# EAGLE schematic PSPS_AVNC_SRD_fullBoard-2020-01-31 (EAGLE 9.5.1)
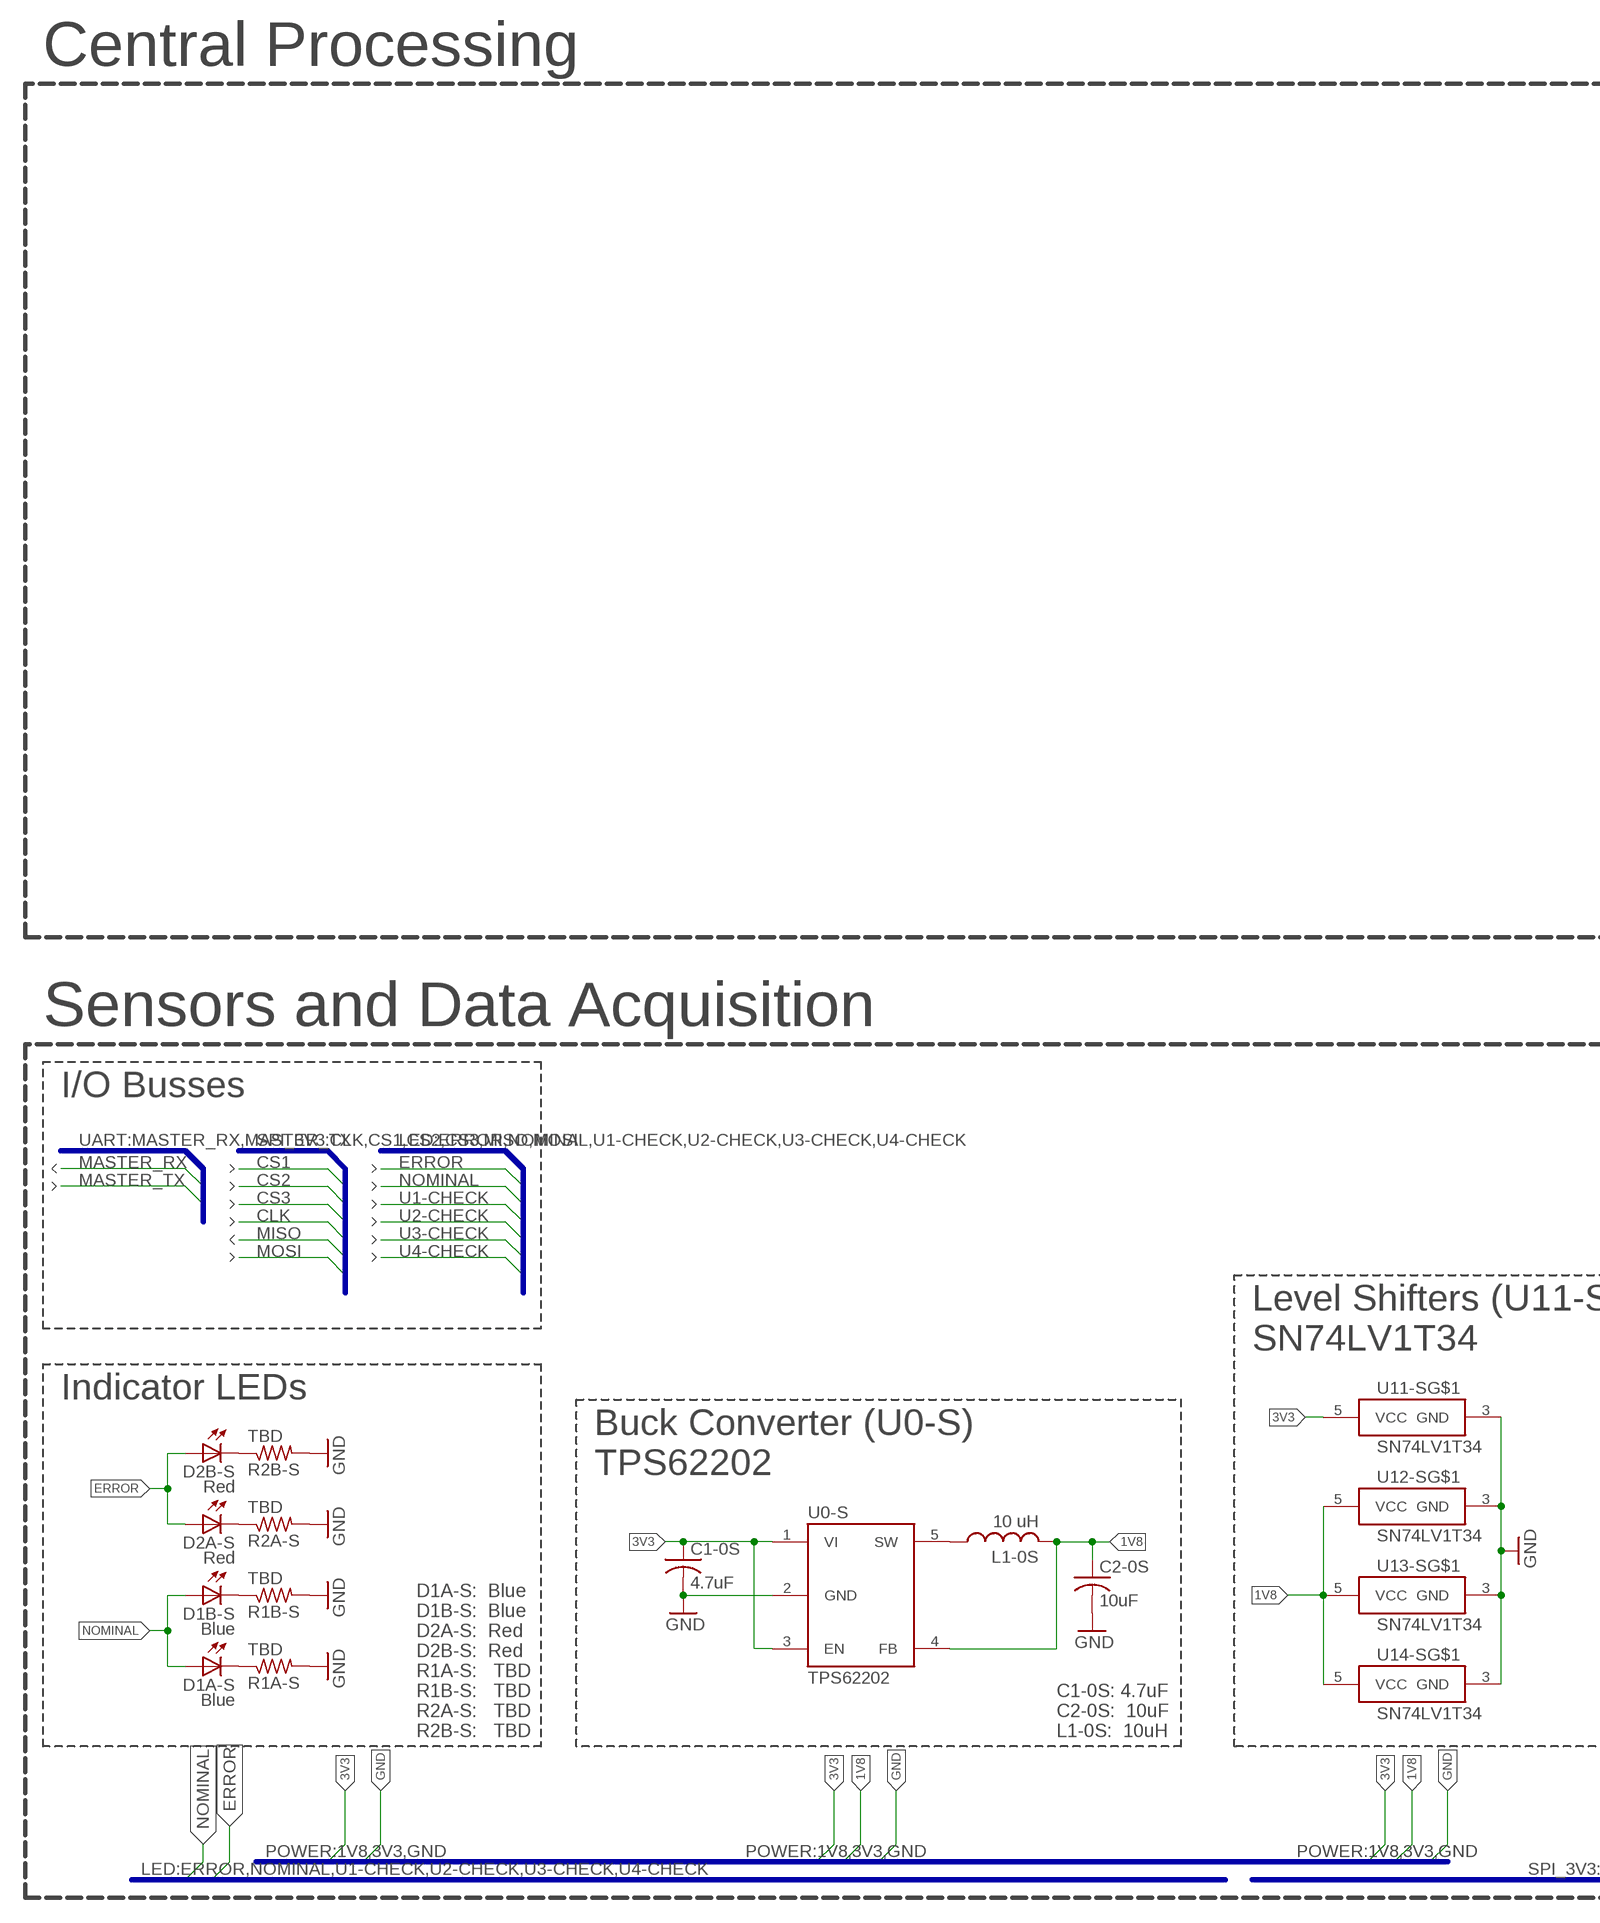
[diagram p0: schematic, sheet 1, part 1 of 2]
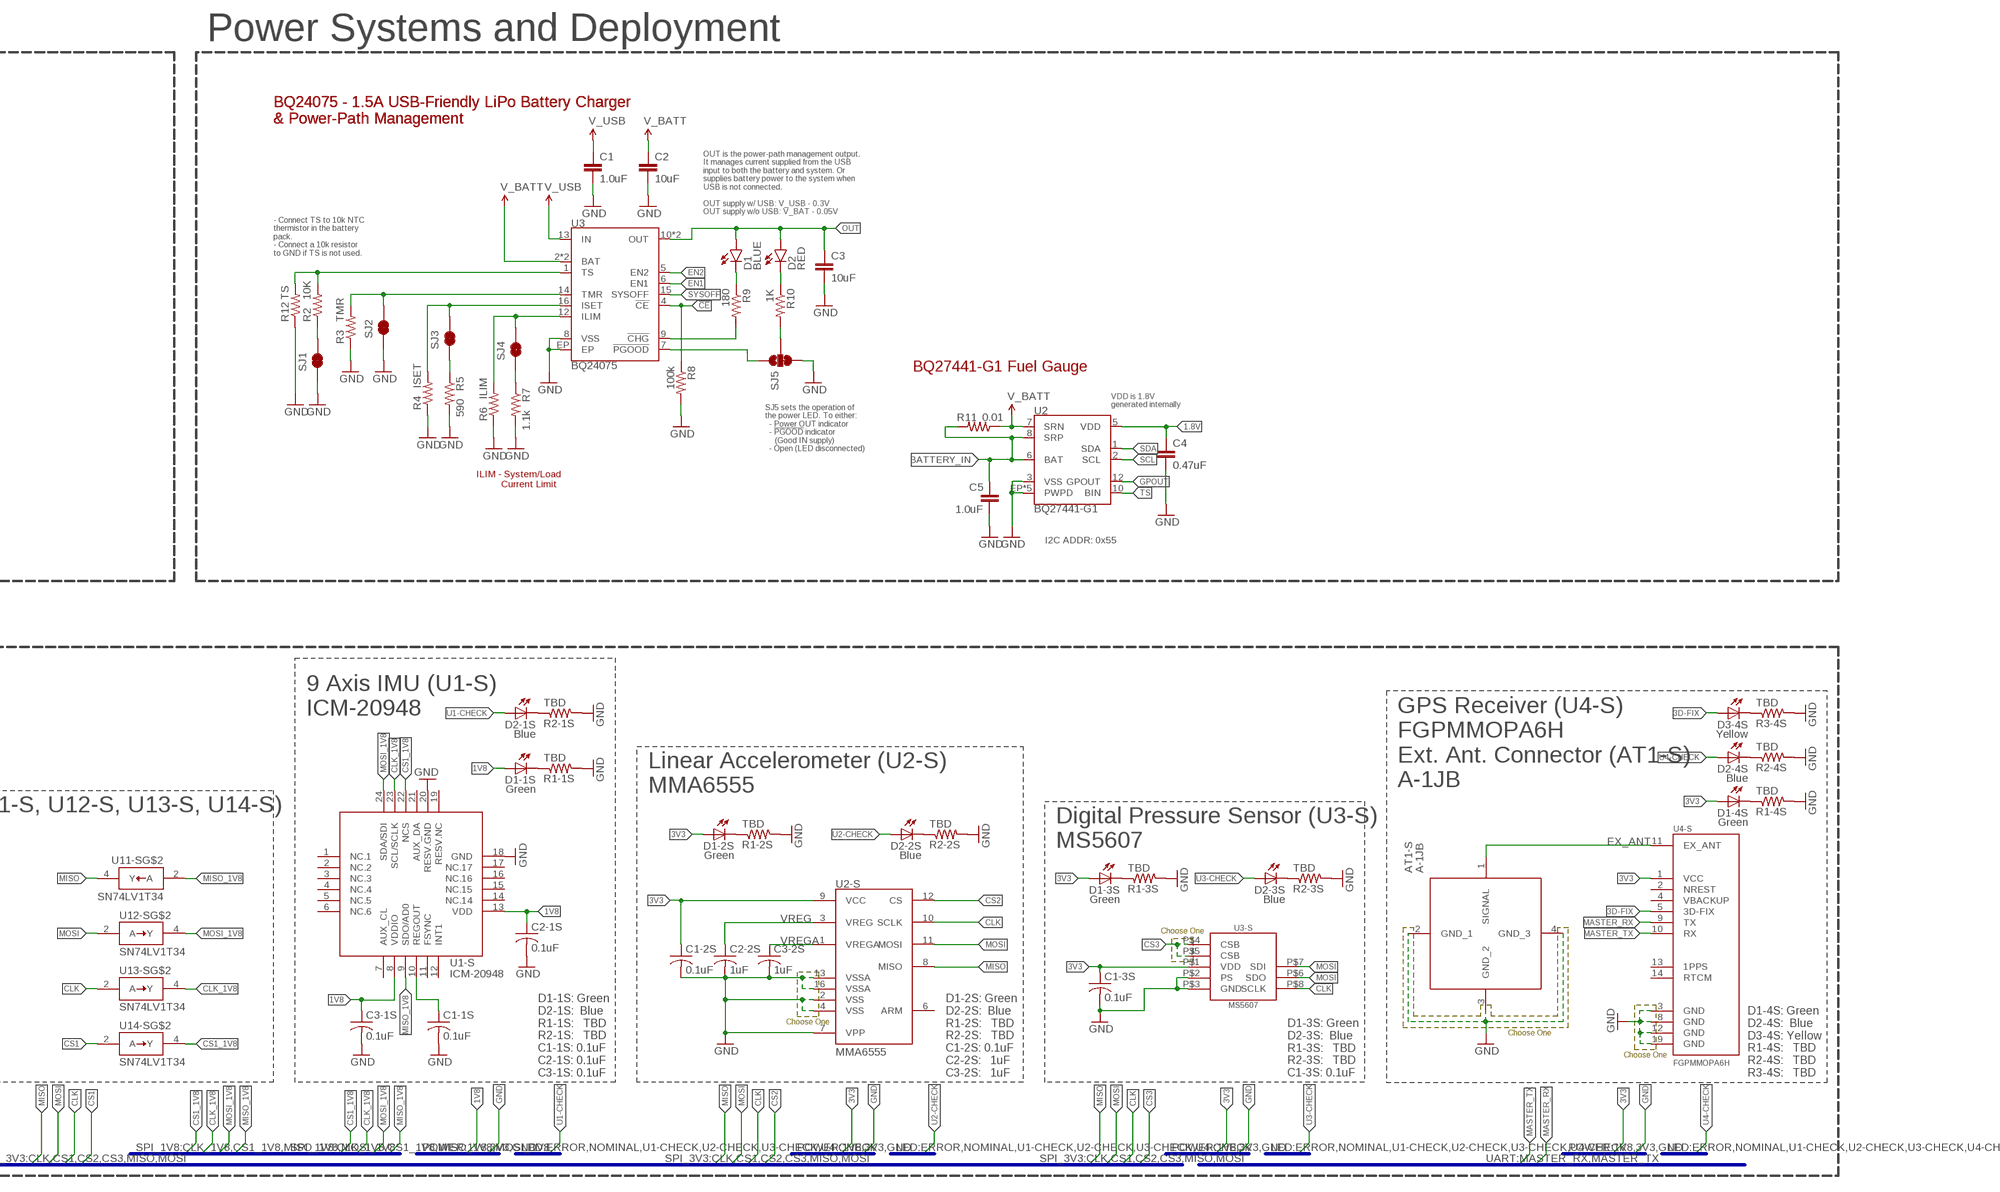
[diagram p1: schematic, sheet 1, part 2 of 2]

## Parts
AT1-S  A-1JB  [A1JB]
C1  1.0uF  1.0UF50V10%(1206)  [1206-CAP]
C1-0S  4.7uF  C-USC0805  [C0805]
C1-1S  0.1uF  C-USC0805  [C0805]
C1-2S  0.1uF  C-USC0805  [C0805]
C1-3S  0.1uF  C-USC0805  [C0805]
C2  10uF  10UF10V10%(0805)  [0805-CAP]
C2-0S  10uF  C-USC0805  [C0805]
C2-1S  0.1uF  C-USC0805  [C0805]
C2-2S  1uF  C-USC0805  [C0805]
C3  10uF  10UF10V10%(0805)  [0805-CAP]
C3-1S  0.1uF  C-USC0805  [C0805]
C3-2S  1uF  C-USC0805  [C0805]
C4  0.47uF  CAP0603-CAP  [0603-CAP]
C5  1.0uF  1.0UF-16V-10%(0603)  [0603-CAP]
D1  BLUE  LED-BLUE0603  [LED-0603]
D1-1S  Green  LEDCHIPLED_0805  [CHIPLED_0805]
D1-2S  Green  LEDCHIPLED_0805  [CHIPLED_0805]
D1-3S  Green  LEDCHIPLED_0805  [CHIPLED_0805]
D1-4S  Green  LEDCHIPLED_0805  [CHIPLED_0805]
D1A-S  Blue  LEDCHIPLED_0805  [CHIPLED_0805]
D1B-S  Blue  LEDCHIPLED_0805  [CHIPLED_0805]
D2  RED  LED-RED0603  [LED-0603]
D2-1S  Blue  LEDCHIPLED_0805  [CHIPLED_0805]
D2-2S  Blue  LEDCHIPLED_0805  [CHIPLED_0805]
D2-3S  Blue  LEDCHIPLED_0805  [CHIPLED_0805]
D2-4S  Blue  LEDCHIPLED_0805  [CHIPLED_0805]
D2A-S  Red  LEDCHIPLED_0805  [CHIPLED_0805]
D2B-S  Red  LEDCHIPLED_0805  [CHIPLED_0805]
D3-4S  Yellow  LEDCHIPLED_0805  [CHIPLED_0805]
L1-0S  10 uH  L-US  [0805]
R1-1S  TBD  R-US_R0805  [R0805]
R1-2S  TBD  R-US_R0805  [R0805]
R1-3S  TBD  R-US_R0805  [R0805]
R1-4S  TBD  R-US_R0805  [R0805]
R1A-S  TBD  R-US_R0805  [R0805]
R1B-S  TBD  R-US_R0805  [R0805]
R2  10K  10KOHM-1/10W-1%(0603)0603  [0603-RES]
R2-1S  TBD  R-US_R0805  [R0805]
R2-2S  TBD  R-US_R0805  [R0805]
R2-3S  TBD  R-US_R0805  [R0805]
R2-4S  TBD  R-US_R0805  [R0805]
R2A-S  TBD  R-US_R0805  [R0805]
R2B-S  TBD  R-US_R0805  [R0805]
R3  TMR  RESISTORPTH-1/6W  [1/6W-RES]
R3-4S  TBD  R-US_R0805  [R0805]
R4  ISET  RESISTORPTH-1/6W  [1/6W-RES]
R5  590  RESISTOR0603-RES  [0603-RES]
R6  ILIM  RESISTORPTH-1/6W  [1/6W-RES]
R7  1.1k  RESISTOR0603-RES  [0603-RES]
R8  100k  100KOHM-1/10W-1%(0603)  [0603-RES]
R9  180  180OHM1/10W1%(0603)  [0603-RES]
R10  1K  1KOHM-1/10W-1%(0603)  [0603-RES]
R11  0.01  RESISTOR1206  [1206]
R12  TS  RESISTORPTH-1/6W  [1/6W-RES]
SJ1  JUMPER-PAD-2-NC_BY_TRACE  [PAD-JUMPER-2-NC_BY_TRACE_YES_SILK]
SJ2  JUMPER-PAD-2-NC_BY_TRACE  [PAD-JUMPER-2-NC_BY_TRACE_YES_SILK]
SJ3  JUMPER-PAD-2-NC_BY_TRACE  [PAD-JUMPER-2-NC_BY_TRACE_YES_SILK]
SJ4  JUMPER-PAD-2-NC_BY_TRACE  [PAD-JUMPER-2-NC_BY_TRACE_YES_SILK]
SJ5  JUMPER-PAD-3-2OF3_NC_BY_TRACE_SMALL  [PAD-JUMPER-3-2OF3_NC_BY_TRACE_YES_SILK_FULL_BOX]
U0-S  TPS62202  [SOT95P280X145-5]
U1-S  ICM-20948  [QFN40P300X300X105-25T159X175]
U2  BQ27441-G1  [PDSO-N12]
U2-S  MMA6555  MMA655X  [QFN100P600X600X198-17T424N]
U3  BQ24075  [PVQFN-N16]
U3-S  MS5607  [MS5607]
U4-S  FGPMMOPA6H  [SOIC127P1800X470-20N]
U11-S  SN74LV1T34  [SOT65P210X110-5]
U12-S  SN74LV1T34  [SOT65P210X110-5]
U13-S  SN74LV1T34  [SOT65P210X110-5]
U14-S  SN74LV1T34  [SOT65P210X110-5]

## Nets
1.8V: C4.1 U2.5(VDD)
1V8: C2-0S.1 C2-1S.1 C3-1S.1 D1-1S.A L1-0S.2 U0-S.4(FB) U1-S.8(VDDIO) U1-S.13(VDD) U12-S.5(VCC) U13-S.5(VCC) U14-S.5(VCC)
3D-FIX: D3-4S.A U4-S.5(3D-FIX)
3V3: C1-0S.1 C1-2S.1 C1-3S.1 D1-2S.A D1-3S.A D1-4S.A U0-S.1(VI) U0-S.3(EN) U2-S.9(VCC) U3-S.P$1(VDD) U4-S.1(VCC) U11-S.5(VCC)
!CE!: R8.1 U3.4(!CE!)
!CHG!: R9.2 U3.9(!CHG!)
!PGOOD!: SJ5.1 U3.7(!PGOOD!)
BATTERY_IN: C5.1 R11.2 U2.6(BAT) U2.8(SRP)
CLK: U2-S.10(SCLK) U3-S.P$8(SCLK) U13-S.2(A)
CLK_1V8: U1-S.23(SCL/SCLK) U13-S.4(Y)
CS1: U14-S.2(A)
CS1_1V8: U1-S.22(NCS) U14-S.4(Y)
CS2: U2-S.12(CS)
CS3: U3-S.P$4(CSB) U3-S.P$5(CSB)
D1-1S_R1-1S: D1-1S.C R1-1S.1
D1-2S_R1-2S: D1-2S.C R1-2S.1
D1-3S_R1-3S: D1-3S.C R1-3S.1
D1-4S_R1-4S: D1-4S.C R1-4S.1
D1A-S_R1A-S: D1A-S.C R1A-S.1
D1B-S_R1B-S: D1B-S.C R1B-S.1
D2-1S_R2-1S: D2-1S.C R2-1S.1
D2-2S_R2-2S: D2-2S.C R2-2S.1
D2-3S_R2-3S: D2-3S.C R2-3S.1
D2-4S_R2-4S: D2-4S.C R2-4S.1
D2A-S_R2A-S: D2A-S.C R2A-S.1
D2B-S_R2B-S: D2B-S.C R2B-S.1
D3-4S_R3-4S: D3-4S.C R3-4S.1
EN1: U3.6(EN1)
EN2: U3.5(EN2)
ERROR: D2A-S.A D2B-S.A
EX_ANT: AT1-S.1(SIGNAL) U4-S.11(EX_ANT)
GND: AT1-S.2(GND_1) AT1-S.3(GND_2) AT1-S.4(GND_3) C1-0S.2 C1-1S.2 C1-2S.2 C1-3S.2 C1.2 C2-0S.2 C2-1S.2 C2-2S.2 C2.2 C3-1S.2 C3-2S.2 C3.2 C4.2 C5.2 R1-1S.2 R1-2S.2 R1-3S.2 R1-4S.2 R1A-S.2 R1B-S.2 R2-1S.2 R2-2S.2 R2-3S.2 R2-4S.2 R2A-S.2 R2B-S.2 R3-4S.2 R3.1 R4.1 R5.2 R6.1 R7.2 R8.2 R12.1 SJ1.1 SJ2.1 SJ5.3 U0-S.2(GND) U1-S.18(GND) U1-S.20(RESV.GND) U2-S.2(VSS) U2-S.4(VSS) U2-S.7(VPP) U2-S.13(VSSA) U2-S.16(VSSA) U2.3(VSS) U2.EP1(PWPD) U2.EP2(PWPD) U2.EP3(PWPD) U2.EP4(PWPD) U2.EP(PWPD) U3-S.P$2(PS) U3-S.P$3(GND) U3.8(VSS) U3.EP U4-S.3(GND) U4-S.8(GND) U4-S.12(GND) U4-S.19(GND) U11-S.3(GND) U12-S.3(GND) U13-S.3(GND) U14-S.3(GND)
GPOUT: U2.12(GPOUT)
ILIM: R6.2 SJ4.2 U3.12(ILIM)
ISET: R4.2 SJ3.2 U3.16(ISET)
MASTER_RX: U4-S.9(TX)
MASTER_TX: U4-S.10(RX)
MISO: U2-S.8(MISO) U11-S.4(Y)
MISO_1V8: U1-S.9(SDO/AD0) U11-S.2(A)
MOSI: U2-S.11(MOSI) U3-S.P$6(SDO) U3-S.P$7(SDI) U12-S.2(A)
MOSI_1V8: U1-S.24(SDA/SDI) U12-S.4(Y)
N$2: R2.1 SJ1.2
N$3: R7.1 SJ4.1
N$4: R5.1 SJ3.1
N$5: R10.2 SJ5.2
N$11: D1.C R9.1
N$12: D2.C R10.1
NOMINAL: D1A-S.A D1B-S.A
OUT: C3.1 D1.A D2.A U3.10(OUT) U3.11(OUT)
REGOUT: C1-1S.1 U1-S.10(REGOUT)
SCL: U2.2(SCL)
SDA: U2.1(SDA)
SW: L1-0S.1 U0-S.5(SW)
SYSOFF: U3.15(SYSOFF)
TMR: R3.2 SJ2.2 U3.14(TMR)
TS: U2.10(BIN)
TS1: R2.2 R12.2 U3.1(TS)
U1-CHECK: D2-1S.A
U2-CHECK: D2-2S.A
U3-CHECK: D2-3S.A
U4-CHECK: D2-4S.A
V_BATT: C2.1 R11.1 U2.7(SRN) U3.2(BAT) U3.3(BAT)
V_USB: C1.1 U3.13(IN)
VREG: C2-2S.1 U2-S.3(VREG)
VREGA: C3-2S.1 U2-S.1(VREGA)
Unconnected: U1-S.1(NC.1) U1-S.2(NC.2) U1-S.3(NC.3) U1-S.4(NC.4) U1-S.5(NC.5) U1-S.6(NC.6) U1-S.7(AUX_CL) U1-S.11(FSYNC) U1-S.12(INT1) U1-S.14(NC.14) U1-S.15(NC.15) U1-S.16(NC.16) U1-S.17(NC.17) U1-S.19(RESV.NC) U1-S.21(AUX_DA) U2-S.6(ARM) U4-S.2(NREST) U4-S.4(VBACKUP) U4-S.13(1PPS) U4-S.14(RTCM)

## Buses
SPI_3V3:CLK,CS1,CS2,CS3,MISO,MOSI
SPI_1V8:CLK_1V8,CS1_1V8,MISO_1V8,MOSI_1V8
POWER:1V8,3V3,GND
LED:ERROR,NOMINAL,U1-CHECK,U2-CHECK,U3-CHECK,U4-CHECK
UART:MASTER_RX,MASTER_TX

## Notes on the sheet
- Central Processing | Power Systems and Deployment
- BQ24075 - 1.5A USB-Friendly LiPo Battery Charger 
  & Power-Path Management
- BQ24075 - 1.5A USB-Friendly LiPo Battery Charger 
  & Power-Path Management
- OUT is the power-path management output.
  It manages current supplied from the USB 
  input to both the battery and system. Or
  supplies battery power to the system when 
  USB is not connected.
  
  OUT supply w/ USB: V_USB - 0.3V
  OUT supply w/o USB: V_BAT - 0.05V
- - Connect TS to 10k NTC 
  thermistor in the battery
  pack.
  - Connect a 10k resistor 
  to GND if TS is not used.
- BQ27441-G1 Fuel Gauge
- VDD is 1.8V
  generated internally
- SJ5 sets the operation of 
  the power LED. To either:
    - Power OUT indicator
    - !PGOOD! indicator 
       (Good IN supply)
    - Open (LED disconnected)
- ILIM - System/Load 
            Current Limit
- I2C ADDR: 0x55
- Sensors and Data Acquisition
- I/O Busses
- 9 Axis IMU (U1-S)
  ICM-20948
- GPS Receiver (U4-S)
  FGPMMOPA6H
  Ext. Ant. Connector (AT1-S)
  A-1JB
- Linear Accelerometer (U2-S)
  MMA6555
- Level Shifters (U11-S, U12-S, U13-S, U14-S)
  SN74LV1T34
- Digital Pressure Sensor (U3-S)
  MS5607
- Indicator LEDs
- Buck Converter (U0-S)
  TPS62202
- Choose One
- Choose One
- Choose One
- Choose One
- D1A-S:  Blue
  D1B-S:  Blue
  D2A-S:  Red
  D2B-S:  Red
  R1A-S:   TBD
  R1B-S:   TBD
  R2A-S:   TBD
  R2B-S:   TBD
- C1-0S: 4.7uF
  C2-0S:  10uF
  L1-0S:  10uH
- D1-1S: Green
  D2-1S:  Blue
  R1-1S:   TBD
  R2-1S:   TBD
  C1-1S: 0.1uF
  C2-1S: 0.1uF
  C3-1S: 0.1uF
- D1-2S: Green
  D2-2S:  Blue
  R1-2S:   TBD
  R2-2S:   TBD
  C1-2S: 0.1uF
  C2-2S:   1uF
  C3-2S:   1uF
- D1-3S: Green
  D2-3S:  Blue
  R1-3S:   TBD
  R2-3S:   TBD
  C1-3S: 0.1uF
- D1-4S: Green
  D2-4S:  Blue
  D3-4S: Yellow
  R1-4S:   TBD
  R2-4S:   TBD
  R3-4S:   TBD

## Library data of the parts
AT1-S = SamacSys_Parts:A-1JB: AMC Straight PCB Jack, Surface Mount Source: Datasheet <https://componentsearchengine.com/Datasheets/1/A-1JB.pdf>; DESCRIPTION: AMC Straight PCB Jack, Surface Mount; HEIGHT: 1.05mm; MANUFACTURER_NAME: Amphenol; MANUFACTURER_PART_NUMBER: A-1JB; MOUSER_PART_NUMBER: 523-A-1JB; MOUSER_PRICE-STOCK: https://www.mouser.com/Search/Refine.aspx?Keyword=523-A-1JB
C1 = SparkFun-Capacitors:1.0UF50V10%(1206): CAP-09822; PROD_ID: CAP-09822
C1-0S C1-1S C1-2S C1-3S C2-0S C2-1S C2-2S C3-1S C3-2S = resistor:C-US: CAPACITOR, American symbol
C2 C3 = SparkFun-Capacitors:10UF10V10%(0805): CAP-11330; PROD_ID: CAP-11330
C4 = SparkFun-Capacitors:CAP: Capacitor Standard 0603 ceramic capacitor, and 0.1" leaded capacitor.; PROD_ID: CAP-13216
C5 = SparkFun-Capacitors:1.0UF-16V-10%(0603): CAP-00868; PROD_ID: CAP-00868
D1 = SparkFun-LED:LED-BLUE: Blue LEDs for production use Various blue LEDs stocked by SparkFun production 0603 - DIO-08575 Rebel - DIO-09553 1206 - DIO-09911; PROD_ID: DIO-08575
D1-1S D1-2S D1-3S D1-4S D1A-S D1B-S D2-1S D2-2S D2-3S D2-4S D2A-S D2B-S D3-4S = adafruit:LED: LED OSRAM: - CHIPLED LG R971, LG N971, LY N971, LG Q971, LY Q971, LO R971, LY R971 LH N974, LH R974 LS Q976, LO Q976, LY Q976 LO Q996 - Hyper CHIPLED LW Q18S LB Q993, LB Q99A, LB R99A - SideLED LS A670, LO A670, LY A670, LG A670, LP A670 LB A673, LV A673, LT A673, LW A673 LH A674 LY A675 LS A676, LA A676, LO A676, LY A676, LW A676 LS A679, LY A679, LG A679 - Hyper Micro SIDELED® LS Y876, LA Y876, LO Y876, LY Y876 LT Y87S - SmartLED LW L88C, LW L88S LB L89C, LB L89S, LG L890 LS L89K, LO L89K, LY L89K LS L896, LA L896, LO L896, LY L896 - TOPLED LS T670, LO T670, LY T670, LG T670, LP T670 LSG T670, LSP T670, LSY T670, LOP T670, LYG T670 LG T671, LOG T671, LSG T671 LB T673, LV T673, LT T673, LW T673 LH T674 LS T676, LA T676, LO T676, LY T676, LB T676, LH T676, LSB T676, LW T676 LB T67C, LV T67C, LT T67C, LS T67K, LO T67K, LY T67K, LW E67C LS E67B, LA E67B, LO E67B, LY E67B, LB E67C, LV E67C, LT E67C LW T67C LS T679, LY T679, LG T679 LS T770, LO T770, LY T770, LG T770, LP T770 LB T773, LV T773, LT T773, LW T773 LH T774 LS E675, LA E675, LY E675, LS T675 LS T776, LA T776, LO T776, LY T776, LB T776 LHGB T686 LT T68C, LB T68C - Hyper Mini TOPLED® LB M676 - Mini TOPLED Santana® LG M470 LS M47K, LO M47K, LY M47K Source: http://www.osram.convergy.de/
D2 = SparkFun-LED:LED-RED: Assorted Red LEDs LilyPad 1206- DIO-09912 1206- DIO-00809 0603- DIO-00819 "SMART" means more efficient and expensive; PROD_ID: DIO-00819
L1-0S = Computer2:L-US
R1-1S R1-2S R1-3S R1-4S R1A-S R1B-S R2-1S R2-2S R2-3S R2-4S R2A-S R2B-S R3-4S = resistor:R-US_: RESISTOR, American symbol
R2 = SparkFun-Resistors:10KOHM-1/10W-1%(0603): RES-00824; PROD_ID: RES-00824
R3 R4 R6 R12 = SparkFun-Resistors:RESISTOR: Resistor Basic schematic elements and footprints for 0603, 1206, and PTH resistors.
R5 = SparkFun-Passives:RESISTOR: Resistor Basic schematic elements and footprints for 0603, 1206, and PTH resistors.; PROD_ID: RES-13217
R7 = SparkFun-Passives:RESISTOR: Resistor Basic schematic elements and footprints for 0603, 1206, and PTH resistors.; PROD_ID: RES-10447
R8 = SparkFun-Resistors:100KOHM-1/10W-1%(0603): RES-07828; PROD_ID: RES-07828
R9 = SparkFun-Resistors:180OHM1/10W1%(0603): RES-08788; PROD_ID: RES-08788
R10 = SparkFun-Resistors:1KOHM-1/10W-1%(0603): RES-07856; PROD_ID: RES-07856
R11 = SparkFun-Resistors:RESISTOR: Resistor Basic schematic elements and footprints for 0603, 1206, and PTH resistors.; PROD_ID: RES-13218
SJ1-SJ4 = SparkFun-Passives:JUMPER-PAD-2-NC_BY_TRACE
SJ5 = SparkFun-Passives:JUMPER-PAD-3-2OF3_NC_BY_TRACE
U0-S = Computer2:TPS62202: 1.8-V Output, 300-mA, 95% Efficient Step-Down Converter in SOT-23 http://www.ti.com/product/TPS62202
U1-S = Computer2:ICM-20948: 9 Axis Motion Sensor from TDK InvenSense https://store.invensense.com/products/detail/ICM20948-InvenSense/597203/
U2 = battery-management-temp:BQ27441-G1; PROD_ID: IC-13220
U2-S = Computer2:MMA655X: MMA655x, Single-Axis, SPI Inertial Sensor MMA655x, a SafeAssure solution, is a SPI-based, single-axis, medium-g, over- damped lateral accelerometer designed for use in Automotive Airbag systems. Features • ±105 g or ±120 g full-scale range • 3.3 V or 5 V single supply operation • SPI-compatible serial interface • 12-bit digital signed or unsigned SPI data output • Programmable arming function • Twelve low-pass filter options, ranging from 50 Hz to 1000 Hz • Optional offset cancellation with > 6 s averaging period and < 0.25 LSB/s slew rate • Pb-free 16-pin QFN, 6 mm x 6 mm package
U3 = battery-management-temp:BQ24075; PROD_ID: IC-13219
U3-S = Computer2:MS5607
U4-S = Computer2:FGPMMOPA6H
U11-S U12-S U13-S U14-S = Computer2:SN74LV1T34: Single Power Supply BUFFER Logic Level Shifter

## Module LEVEL_SHIFTERS
Ports: 

### Library data of the parts